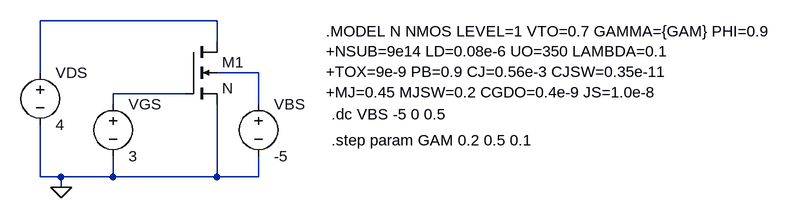
[diagram p0: schematic MOSFET-Gamma.asc]
MOSFET-Gamma.asc, the LTspice schematic file:
Version 4
SHEET 1 880 680
WIRE -32 -16 -304 -16
WIRE -32 16 -32 -16
WIRE -304 64 -304 -16
WIRE 32 64 -32 64
WIRE -80 96 -192 96
WIRE -192 112 -192 96
WIRE 32 112 32 64
WIRE -304 224 -304 144
WIRE -272 224 -304 224
WIRE -192 224 -192 192
WIRE -192 224 -272 224
WIRE -32 224 -32 112
WIRE -32 224 -192 224
WIRE 32 224 32 192
WIRE 32 224 -32 224
WIRE -272 240 -272 224
FLAG -272 240 0
SYMBOL nmos4 -80 16 R0
SYMATTR InstName M1
SYMATTR Value N
SYMATTR Value2 l=4u w=1u
SYMBOL voltage -304 48 R0
WINDOW 123 0 0 Left 0
WINDOW 39 0 0 Left 0
SYMATTR InstName VDS
SYMATTR Value 4
SYMBOL voltage -192 96 R0
WINDOW 123 0 0 Left 0
WINDOW 39 0 0 Left 0
SYMATTR InstName VGS
SYMATTR Value 3
SYMBOL voltage 32 96 R0
WINDOW 123 0 0 Left 0
WINDOW 39 0 0 Left 0
SYMATTR InstName VBS
SYMATTR Value -5
TEXT 136 0 Left 2 !.MODEL N NMOS LEVEL=1 VTO=0.7 GAMMA={GAM} PHI=0.9\n+NSUB=9e14 LD=0.08e-6 UO=350 LAMBDA=0.1\n+TOX=9e-9 PB=0.9 CJ=0.56e-3 CJSW=0.35e-11\n+MJ=0.45 MJSW=0.2 CGDO=0.4e-9 JS=1.0e-8
TEXT 144 128 Left 2 !.dc VBS -5 0 0.5
TEXT 144 168 Left 2 !.step param GAM 0.2 0.5 0.1

The netlist it stands for:
* MOSFET-Gamma.asc
M1 N001 N003 0 N002 N l=4u w=1u
VDS N001 0 4
VGS N003 0 3
VBS N002 0 -5
.model NMOS NMOS
.model PMOS PMOS
.lib standard.mos
.MODEL N NMOS LEVEL=1 VTO=0.7 GAMMA={GAM} PHI=0.9
+NSUB=9e14 LD=0.08e-6 UO=350 LAMBDA=0.1
+TOX=9e-9 PB=0.9 CJ=0.56e-3 CJSW=0.35e-11
+MJ=0.45 MJSW=0.2 CGDO=0.4e-9 JS=1.0e-8
.dc VBS -5 0 0.5
.step param GAM 0.2 0.5 0.1
.backanno
.end